# EAGLE design SmartCup1 (EAGLE 6.5.0)
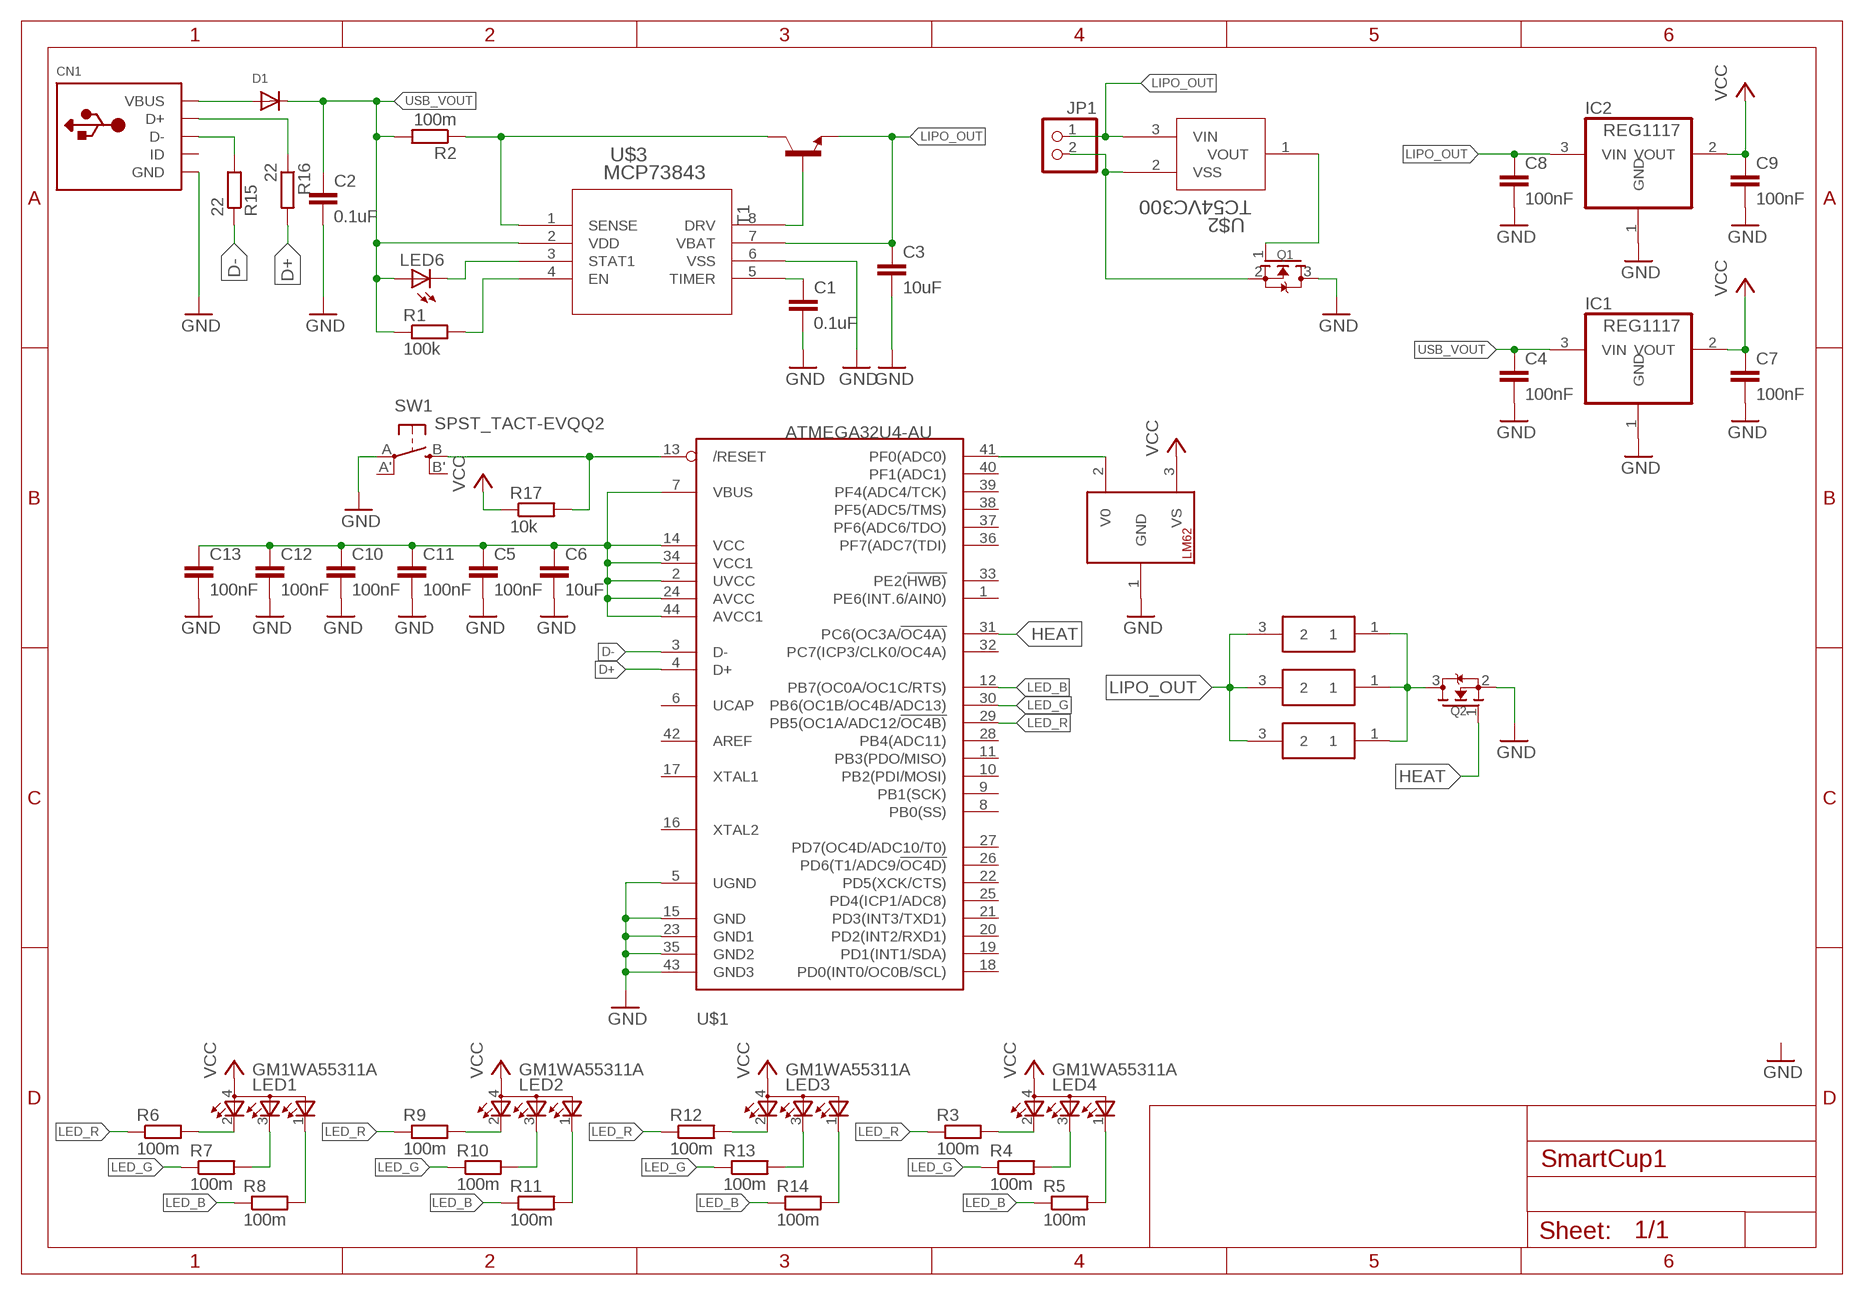
[diagram p0: schematic, sheet 1]

## Parts
C1  0.1uF  C-EUC0603  [C0603]
C2  0.1uF  C-EUC0603  [C0603]
C3  10uF  C-EUC0603  [C0603]
C4  100nF  C-EUC0603  [C0603]
C5  100nF  C-EUC0603  [C0603]
C6  10uF  C-EUC0805  [C0805]
C7  100nF  C-EUC0603  [C0603]
C8  100nF  C-EUC0603  [C0603]
C9  100nF  C-EUC0603  [C0603]
C10  100nF  C-EUC0603  [C0603]
C11  100nF  C-EUC0603  [C0603]
C12  100nF  C-EUC0603  [C0603]
C13  100nF  C-EUC0603  [C0603]
CN1  USBMINIB  [USB-MINIB]
D1  DIODE_SOD-123FL  [SOD-123FL]
IC1  REG1117  [SOT223]
IC2  REG1117  [SOT223]
JP1  PINHD-1X2  [1X02]
LED1  GM1WA55311A  [GM1WA55311A]
LED2  GM1WA55311A  [GM1WA55311A]
LED3  GM1WA55311A  [GM1WA55311A]
LED4  GM1WA55311A  [GM1WA55311A]
LED6  LEDCHIP-LED0603  [CHIP-LED0603]
Q1  MOSFET-NREFLOW  [SOT23]
Q2  MOSFET-NREFLOW  [SOT23]
R1  100k  R-EU_R0603  [R0603]
R2  100m  R-EU_R0603  [R0603]
R3  100m  R-EU_R0603  [R0603]
R4  100m  R-EU_R0603  [R0603]
R5  100m  R-EU_R0603  [R0603]
R6  100m  R-EU_R0603  [R0603]
R7  100m  R-EU_R0603  [R0603]
R8  100m  R-EU_R0603  [R0603]
R9  100m  R-EU_R0603  [R0603]
R10  100m  R-EU_R0603  [R0603]
R11  100m  R-EU_R0603  [R0603]
R12  100m  R-EU_R0603  [R0603]
R13  100m  R-EU_R0603  [R0603]
R14  100m  R-EU_R0603  [R0603]
R15  22  R-EU_R0603  [R0603]
R16  22  R-EU_R0603  [R0603]
R17  10k  R-EU_R0603  [R0603]
SW1  SPST_TACT-EVQQ2  [EVQ-Q2]
T1  -NPN-SOT23-EBC  [SOT23-EBC]
U$1  ATMEGA32U4-AU  [TQFP44]
U$2  TC54VC300  [SOT23]
U$3  MCP73843  [MSOP8_MC]
U$4  LM62TO-92  [TO92-]
U$6  BOURNS_PWR  [DPAK]
U$7  BOURNS_PWR  [DPAK]
U$8  BOURNS_PWR  [DPAK]

## Nets
D+: R16.2 U$1.4(D+)
D-: R15.1 U$1.3(D-)
GND: C1.2 C2.2 C3.2 C4.2 C5.2 C6.2 C7.2 C8.2 C9.2 C10.2 C11.2 C12.2 C13.2 CN1.GND IC1.1(GND) IC2.1(GND) Q1.3(D) Q2.2(S) SW1.A(P) U$1.5(UGND) U$1.15(GND) U$1.23(GND1) U$1.35(GND2) U$1.43(GND3) U$3.6(VSS) U$4.1(GND)
HEAT: Q2.1(G) U$1.31(PC6(OC3A/!OC4A))
LED_B: R5.1 R8.1 R11.1 R14.1 U$1.12(PB7(OC0A/OC1C/RTS))
LED_G: R4.1 R7.1 R10.1 R13.1 U$1.30(PB6(OC1B/OC4B/ADC13))
LED_R: R3.1 R6.1 R9.1 R12.1 U$1.29(PB5(OC1A/ADC12/!OC4B))
LIPO_OUT: C3.1 C8.1 IC2.3(VIN) JP1.1 T1.E U$2.3(VIN) U$3.7(VBAT) U$6.3 U$7.3 U$8.3
N$1: Q1.1(G) U$2.1(VOUT)
N$2: LED6.C U$3.3(STAT1)
N$3: CN1.VBUS D1.A
N$4: R1.2 U$3.4(EN)
N$5: T1.B U$3.8(DRV)
N$6: C1.1 U$3.5(TIMER)
N$7: LED4.2(CRED) R3.2
N$8: JP1.2 Q1.2(S) U$2.2(VSS)
N$9: LED3.2(CRED) R12.2
N$10: LED4.3(CBLUE) R4.2
N$11: R2.1 T1.C U$3.1(SENSE)
N$12: LED4.1(CGREEN) R5.2
N$13: LED1.2(CRED) R6.2
N$14: LED1.3(CBLUE) R7.2
N$15: LED1.1(CGREEN) R8.2
N$16: LED2.2(CRED) R9.2
N$17: LED2.3(CBLUE) R10.2
N$18: LED2.1(CGREEN) R11.2
N$19: LED3.3(CBLUE) R13.2
N$20: C5.1 C6.1 C10.1 C11.1 C12.1 C13.1 U$1.2(UVCC) U$1.7(VBUS) U$1.14(VCC) U$1.24(AVCC) U$1.34(VCC1) U$1.44(AVCC1)
N$21: LED3.1(CGREEN) R14.2
N$22: U$1.41(PF0(ADC0)) U$4.2(V0)
N$23: CN1.D- R15.2
N$24: CN1.D+ R16.1
N$25: R17.2 SW1.B(S) U$1.13(/RESET)
N$26: Q2.3(D) U$6.1 U$7.1 U$8.1
USB_VOUT: C2.1 C4.1 D1.C IC1.3(VIN) LED6.A R1.1 R2.2 U$3.2(VDD)
VCC: C7.1 C9.1 IC1.2(VOUT) IC2.2(VOUT) LED1.4(A) LED2.4(A) LED3.4(A) LED4.4(A) R17.1 U$4.3(VS)
Unconnected: CN1.ID SW1.A'(P1) SW1.B'(S1) U$1.1(PE6(INT.6/AIN0)) U$1.6(UCAP) U$1.8(PB0(SS)) U$1.9(PB1(SCK)) U$1.10(PB2(PDI/MOSI)) U$1.11(PB3(PDO/MISO)) U$1.16(XTAL2) U$1.17(XTAL1) U$1.18(PD0(INT0/OC0B/SCL)) U$1.19(PD1(INT1/SDA)) U$1.20(PD2(INT2/RXD1)) U$1.21(PD3(INT3/TXD1)) U$1.22(PD5(XCK/CTS)) U$1.25(PD4(ICP1/ADC8)) U$1.26(PD6(T1/ADC9/!OC4D)) U$1.27(PD7(OC4D/ADC10/T0)) U$1.28(PB4(ADC11)) U$1.32(PC7(ICP3/CLK0/OC4A)) U$1.33(PE2(!HWB)) U$1.36(PF7(ADC7(TDI)) U$1.37(PF6(ADC6/TDO)) U$1.38(PF5(ADC5/TMS)) U$1.39(PF4(ADC4/TCK)) U$1.40(PF1(ADC1)) U$1.42(AREF)

## Library data of the parts
C1-C13 = resistor:C-EU: CAPACITOR, European symbol
CN1 = adafruit:USB: USB Connectors USBMINIB - Surface Mount Female Mini-B USB Connector 4UConnector: 06564 By microbuilder.eu Thru-hole RA Female Mini-B USB Connector 4UConnector: 18732 By ladyada.net
D1 = adafruit:DIODE: Diode SMADIODE - SMA Surface Mount Package 20V 1A Schottky Diode Digikey: 641-1014-6-ND DO-1N4148 - Through Hole Small Current Diode SOD-123 20V 1 A (.5mV Vf) Schottky Diode - Digikey: MBRX120TPMSCT-ND SOD-323 10V 570mA (.38mV Vf, 3ns) Schottky Diode - Digikey: ZLLS410CT-ND SOD-523 30V 30mA Schottky Diode (RB751S-40TE61) - Digikey: RB751S-40TE61CT-ND SOT23-R/W - SOT23 Package (R = Solder Paste/Reflow Ovens, W = Hand-Soldering) BAT54Film 40V 300mA - Digikey: 497-7162-1-ND
IC1 IC2 = burr-brown:REG1117: 800mA and 1A Low Dropout (LDO) Positive Regulator 1.8V, 2.5V, 2.85V, 3.3V, 5V, and Adj; MPN: REG1117; OC_FARNELL: 1097566; OC_NEWARK: 14P6981
JP1 = pinhead:PINHD-1X2: PIN HEADER
LED1-LED4 = led:GM1WA55311A: Chip LED RGB Source: http://document.sharpsma.com/files/GM1WA55311A_SS.pdf
LED6 = adafruit:LED: LED OSRAM: - CHIPLED LG R971, LG N971, LY N971, LG Q971, LY Q971, LO R971, LY R971 LH N974, LH R974 LS Q976, LO Q976, LY Q976 LO Q996 - Hyper CHIPLED LW Q18S LB Q993, LB Q99A, LB R99A - SideLED LS A670, LO A670, LY A670, LG A670, LP A670 LB A673, LV A673, LT A673, LW A673 LH A674 LY A675 LS A676, LA A676, LO A676, LY A676, LW A676 LS A679, LY A679, LG A679 - Hyper Micro SIDELED® LS Y876, LA Y876, LO Y876, LY Y876 LT Y87S - SmartLED LW L88C, LW L88S LB L89C, LB L89S, LG L890 LS L89K, LO L89K, LY L89K LS L896, LA L896, LO L896, LY L896 - TOPLED LS T670, LO T670, LY T670, LG T670, LP T670 LSG T670, LSP T670, LSY T670, LOP T670, LYG T670 LG T671, LOG T671, LSG T671 LB T673, LV T673, LT T673, LW T673 LH T674 LS T676, LA T676, LO T676, LY T676, LB T676, LH T676, LSB T676, LW T676 LB T67C, LV T67C, LT T67C, LS T67K, LO T67K, LY T67K, LW E67C LS E67B, LA E67B, LO E67B, LY E67B, LB E67C, LV E67C, LT E67C LW T67C LS T679, LY T679, LG T679 LS T770, LO T770, LY T770, LG T770, LP T770 LB T773, LV T773, LT T773, LW T773 LH T774 LS E675, LA E675, LY E675, LS T675 LS T776, LA T776, LO T776, LY T776, LB T776 LHGB T686 LT T68C, LB T68C - Hyper Mini TOPLED® LB M676 - Mini TOPLED Santana® LG M470 LS M47K, LO M47K, LY M47K Source: http://www.osram.convergy.de/
Q1 Q2 = adafruit:MOSFET-N: N-Channel Mosfet 2N7002E - 60V 260mA SOT23 [Digikey: 2N7002ET1GOSTR-ND] - REEL BSH103 - 30V 850mA SOT23 [Digikey: 568-5013-1-ND]
R1-R17 = resistor:R-EU_: RESISTOR, European symbol
SW1 = adafruit:SPST_TACT: SMT 6mm switch, EVQQ2 series http://www.ladyada.net/library/eagle
T1 = transistor:*-NPN-: NPN Transistror BF959 corrected 2008.03.06
U$1 = adafruit:ATMEGA32U4: http://www.ladyada.net/library/eagle
U$2 = TC54VC27:TC54VC300
U$3 = MCP73843:MCP73843
U$4 = LM62:LM62
U$6-U$8 = BOURNS:BOURNS_PWR

## Board
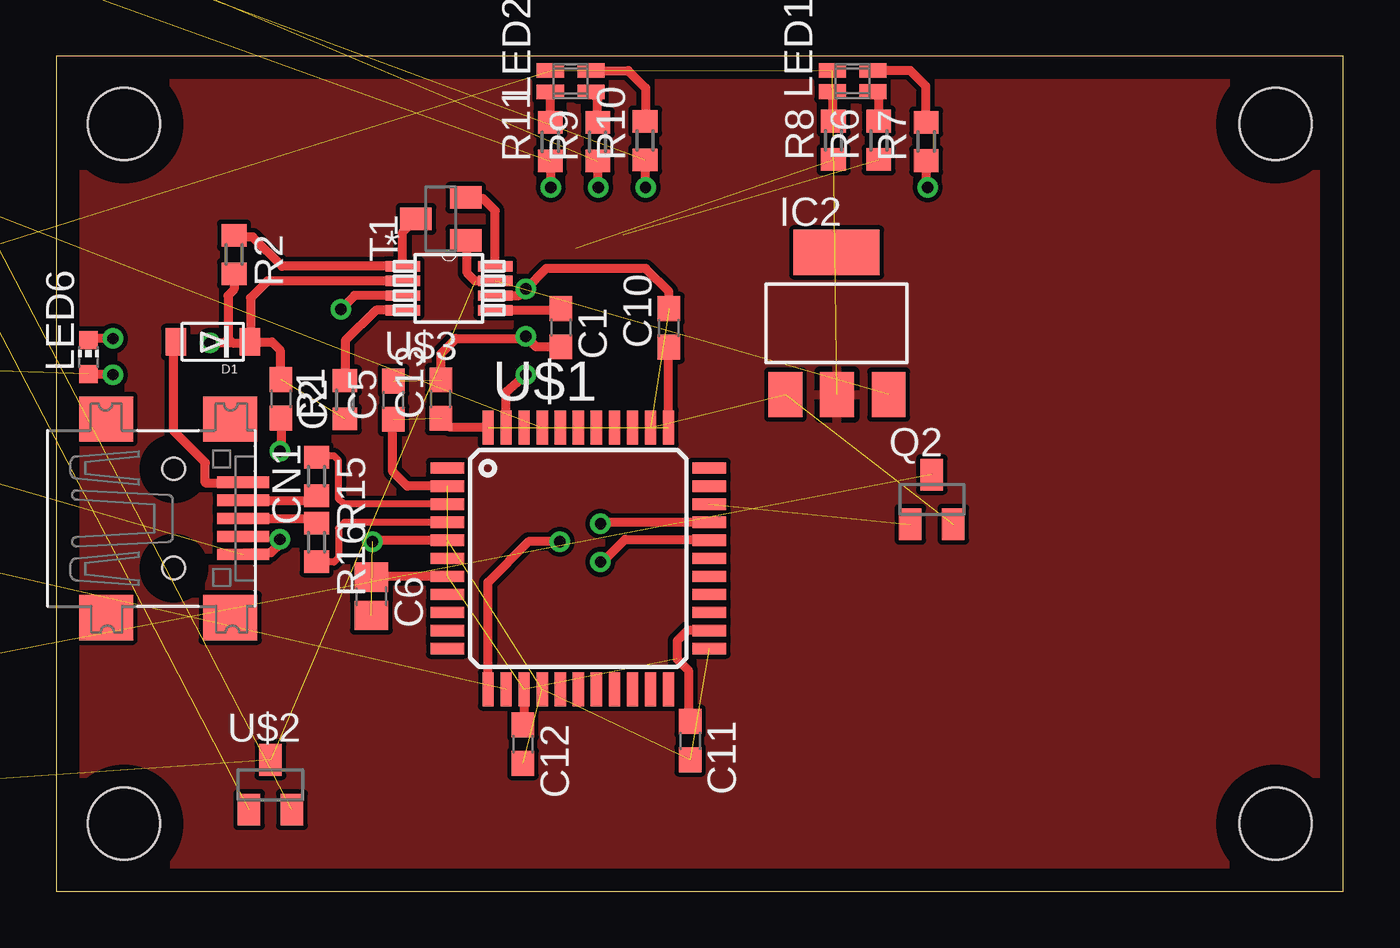
[diagram p1: board, top side]
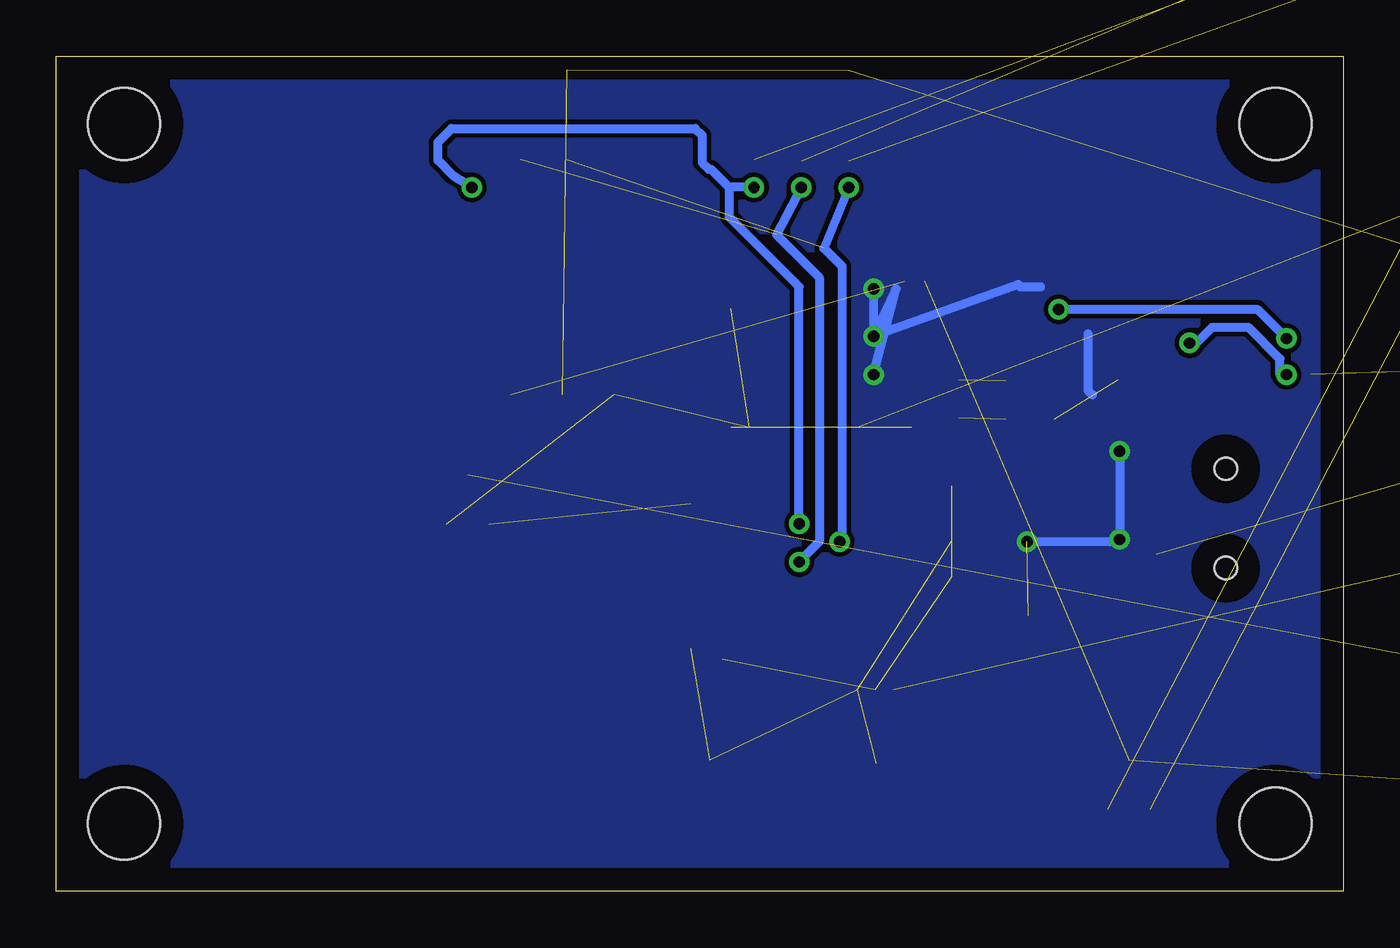
[diagram p2: board, bottom side, seen from below]

Size 57 x 37 mm. Coordinates in mm from the lower left corner, seen from the top.
Outline: 0,0 57,0 57,37 0,37 0,0
Copper layers (1*16): Top 0.035mm / dielectric 1.5mm / Bottom 0.035mm
Design rules "default": minimum track width 10mil, minimum drill 24mil, track to track 8mil, track to pad 8mil, pad to pad 8mil, via to via 8mil, smd to smd 8mil, copper to edge 40mil, drill to drill 8mil, minimum pad ring 10mil, minimum via ring 8mil, stop-mask expansion 4mil, vias tented up to drill 0mil, thermal gap 10mil
Holes 3.2 mm at 3,3 54,3 54,34 3,34

### Footprints (pad centres in the part's own frame; a part is rotated, then mirrored left to right if it is on the bottom)
C0603 = smd 1.1 x 1: 1 -0.85,0; 2 0.85,0
C0805 = smd 1.3 x 1.5: 1 -0.85,0; 2 0.85,0
USB-MINIB = smd 0.5 x 2.308: D+ 0,4.064; D- -0.8,4.064; GND 1.6,4.064; ID 0.8,4.064; VBUS -1.6,4.064 | smd 2 x 2.4: GND1 -4.4,-2; GND2 -4.4,3.5; GND3 4.4,3.5; GND4 4.4,-2 | hole 1: -2.2,1; 2.2,1
SOD-123FL = smd 0.91 x 1.22: A 1.637,0; C -1.637,0
SOT223 = smd 1.499 x 2.007: 1 -2.261,-3.15; 2 0.025,-3.15; 3 2.311,-3.15 | smd 3.81 x 2.007: 4 0,3.15
1X02 = drill 1.016 long: 1 -1.27,0; 2 1.27,0
GM1WA55311A = smd 0.65 x 1.2: 1 -0.475,0.9; 2 -0.475,-0.9; 3 0.475,-0.9; 4 0.475,0.9
CHIP-LED0603 = smd 0.8 x 0.8: A 0,-0.75; C 0,0.75
SOT23 = smd 1 x 1.4: 1 -0.95,-1.1; 2 0.95,-1.1; 3 0,1.1
R0603 = smd 1 x 1.1: 1 -0.85,0; 2 0.85,0
EVQ-Q2 = smd 3.2 x 1.2: A -3.4,-2; A' 3.4,-2; B -3.4,2; B' 3.4,2
SOT23-EBC = smd 1 x 1.4: B 0.95,-1.1; C 0,1.1; E -0.95,-1.1
TQFP44 = smd 1.5 x 0.5: 1 -5.8,4; 2 -5.8,3.2; 3 -5.8,2.4; 4 -5.8,1.6; 5 -5.8,0.8; 6 -5.8,0; 7 -5.8,-0.8; 8 -5.8,-1.6; 9 -5.8,-2.4; 10 -5.8,-3.2; 11 -5.8,-4; 23 5.8,-4; 24 5.8,-3.2; 25 5.8,-2.4; 26 5.8,-1.6; 27 5.8,-0.8; 28 5.8,0; 29 5.8,0.8; 30 5.8,1.6; 31 5.8,2.4; 32 5.8,3.2; 33 5.8,4 | smd 0.5 x 1.5: 12 -4,-5.8; 13 -3.2,-5.8; 14 -2.4,-5.8; 15 -1.6,-5.8; 16 -0.8,-5.8; 17 0,-5.8; 18 0.8,-5.8; 19 1.6,-5.8; 20 2.4,-5.8; 21 3.2,-5.8; 22 4,-5.8; 34 4,5.8; 35 3.2,5.8; 36 2.4,5.8; 37 1.6,5.8; 38 0.8,5.8; 39 0,5.8; 40 -0.8,5.8; 41 -1.6,5.8; 42 -2.4,5.8; 43 -3.2,5.8; 44 -4,5.8
MSOP8_MC = smd 1.524 x 0.457: 1 -2.045,0.975; 2 -2.045,0.325; 3 -2.045,-0.325; 4 -2.045,-0.975; 5 2.045,-0.975; 6 2.045,-0.325; 7 2.045,0.325; 8 2.045,0.975
TO92- = drill 0.813 long: 1 2.54,-1.27; 2 0,-1.27; 3 -2.54,-1.27
DPAK = smd 1.6 x 3: 1 -2.28,-4.04; 3 2.28,-4.04 | smd 4.826 x 4.191: 4 0,2.096

### Placement (x,y rotation side)
C1  22.35,24.98 270 top
C2  9.95,21.83 270 top
C3  -30.48,69.85 0 top  (outside the outline)
C4  -17.78,64.77 0 top  (outside the outline)
C5  14.93,21.77 90 top
C6  13.95,13.08 270 top
C7  -30.48,64.77 0 top  (outside the outline)
C8  -36.83,64.77 0 top  (outside the outline)
C9  -43.18,64.77 0 top  (outside the outline)
C10  27.13,24.97 90 top
C11  28.07,6.68 270 top
C12  20.67,6.53 270 top
C13  17.03,21.82 90 top
CN1  4.2,16.53 270 top
D1  6.93,24.35 180 top
IC1  -19.05,26.67 0 top  (outside the outline)
IC2  34.56,25.17 0 top
JP1  -60.96,44.45 0 top  (outside the outline)
LED1  35.27,35.91 90 top
LED2  22.78,35.9 90 top
LED3  -39.37,45.72 0 top  (outside the outline)
LED4  -53.34,45.72 0 top  (outside the outline)
LED6  1.42,23.68 0 top
Q1  -15.24,52.07 0 top  (outside the outline)
Q2  38.78,17.37 0 top
R1  12.78,21.79 90 top
R2  7.87,28.22 270 top
R3  -39.37,52.07 0 top  (outside the outline)
R4  -45.72,52.07 0 top  (outside the outline)
R5  -52.07,52.07 0 top  (outside the outline)
R6  36.43,33.28 90 top
R7  38.53,33.23 90 top
R8  34.43,33.28 90 top
R9  23.98,33.22 90 top
R10  26.08,33.27 90 top
R11  21.88,33.22 90 top
R12  -36.83,58.42 0 top  (outside the outline)
R13  -43.18,58.42 0 top  (outside the outline)
R14  -49.53,58.42 0 top  (outside the outline)
R15  11.52,18.39 270 top
R16  11.52,15.47 270 top
R17  -69.85,58.42 0 top  (outside the outline)
SW1  -57.15,25.4 0 top  (outside the outline)
T1  17.03,29.8 90 top
U$1  23.12,14.76 0 top
U$2  9.48,4.73 0 top
U$3  17.39,26.73 0 top
U$4  -20.32,38.1 0 top  (outside the outline)
U$6  -43.18,6.35 0 top  (outside the outline)
U$7  -54.61,6.35 0 top  (outside the outline)
U$8  -66.04,6.35 0 top  (outside the outline)

### Tracks (layer width: path | path; a pad name or v marks a point on that pad's centre or on a via)
D+
  Top 0.305: U$1.4 12.76,16.36 12.5,16.1 12.5,14.8 12.3,14.6 11.54,14.6 R16.2
D-
  Top 0.305: U$1.3 12.74,17.16 12.5,17.4 12.5,19.1 12.3,19.3 11.58,19.3 R15.1
GND  (via drill 0.5)  (18 unrouted)
  Top 0.406: C1.2 21.27,24.13 v20.8,24.6 20.7,24.5 17.7,24.5 17.03,23.83 C13.2 | U$3.6 20.5,26.41 v20.8,26.7 21.7,27.6 26.1,27.6 27.13,26.57 C10.2 | U$1.43 19.92,22.12 v20.8,22.9 | C2.2 9.95,19.55 v9.9,19.5 | v9.9,15.6 9.9,15.4 9.5,15 8.33,15 CN1.GND | U$1.5 14.06,15.56 v14,15.5
  Bottom 0.406: v20.8,24.6 14.4,26.9 14.3,26.8 13.4,26.8 | 11.3,24.7 11.3,22.2 11.1,22 | v20.8,26.7 v20.8,24.6 | v20.8,22.9 19.8,26.7 v20.8,24.6 | v9.9,19.5 v9.9,15.6 10,15.5 v14,15.5
  pour Bottom: 0,0 57,0 57,37 0,37
HEAT  (1 unrouted)
LED_B  (via drill 0.5)  (3 unrouted)
  Top 0.406: U$1.12 19.12,13.7 20.92,15.5 v22.3,15.5 | 21.9,32.35 R11.1 21.88,31.22 v21.9,31.2
  Bottom 0.406: v21.9,31.2 23,28.5 22.2,27.7 22.2,15.6 v22.3,15.5
LED_G  (via drill 0.5)  (2 unrouted)
  Top 0.406: U$1.30 24.16,16.36 v24.1,16.3 | R10.1 26.08,31.22 v26.1,31.2 | R7.1 38.53,31.27 v38.6,31.2
  Bottom 0.406: v24.1,16.3 24.1,26.8 27.2,29.9 27.2,31.2 | v26.1,31.2 27.2,31.2 | v38.6,31.2 39.4,31.7 40.1,32.4 40.1,33.2 39.5,33.8 28.7,33.8 28.4,33.5 28.4,32.3 28.1,32 28,32 27.2,31.2
LED_R  (via drill 0.5)  (3 unrouted)
  Top 0.406: R9.1 23.98,31.22 v24,31.2 | v24.1,14.6 24.2,14.6 25.2,15.6 28.88,15.6 U$1.29
  Bottom 0.406: v24,31.2 25.1,29.1 23.2,27.2 23.2,15.5 v24.1,14.6
LIPO_OUT  (8 unrouted)
  Top 0.406: U$3.7 18.55,27.05 18.2,27.4 18.2,28.78 T1.E
N$1  (1 unrouted)
N$2  (via drill 0.5)
  Top 0.406: U$3.3 13.21,26.41 v12.6,25.8 | v2.5,24.5 1.49,24.5 LED6.C
  Bottom 0.406: v12.6,25.8 3.8,25.8 v2.5,24.5
N$3
  Top 0.406: CN1.VBUS 8.23,18.1 6.6,18.1 6.6,19 5.2,20.4 5.2,24.26 D1.A
N$4
  Top 0.406: U$3.4 14.15,25.75 12.8,24.4 12.8,22.66 R1.2
N$5
  Top 0.406: U$3.8 19.43,30.16 18.9,30.7 18.18,30.7 T1.B
N$6
  Top 0.406: U$3.5 22.27,25.75 C1.1
N$7  (1 unrouted)
N$8  (2 unrouted)
N$9  (1 unrouted)
N$10  (1 unrouted)
N$11
  Top 0.406: R2.1 7.94,29 8.7,29 9.99,27.7 U$3.1 15.35,29.21 T1.C
N$12  (1 unrouted)
N$13
  Top 0.406: R6.2 36.43,35.17 LED1.2
N$14
  Top 0.406: LED1.3 37.81,36.38 38.5,35.7 38.5,34.11 R7.2
N$15
  Top 0.406: LED1.1 34.37,34.19 R8.2
N$16
  Top 0.406: R9.2 23.98,35.12 LED2.2
N$17
  Top 0.406: LED2.3 25.32,36.38 26.1,35.6 26.1,34.14 R10.2
N$18
  Top 0.406: R11.2 LED2.1
N$19  (1 unrouted)
N$20  (5 unrouted)
  Top 0.406: U$1.7 13.98,13.96 C6.1 | U$1.2 15.54,17.96 14.9,18.6 14.9,20.89 C5.1 | U$1.44 17.44,20.56 C13.1 | U$1.14 20.72,7.43 C12.1 | U$1.34 C10.1 | U$1.24 27.96,11.56 27.5,11.1 27.5,10.3 28,9.8 28,7.6 C11.1
N$21  (1 unrouted)
N$22  (1 unrouted)
N$23
  Top 0.406: CN1.D- 11.31,17.33 R15.2
N$24
  Top 0.406: CN1.D+ 11.31,16.53 R16.1
N$25  (2 unrouted)
N$26  (3 unrouted)
USB_VOUT  (via drill 0.5)  (3 unrouted)
  Top 0.406: U$3.2 9.36,27.05 8.6,26.3 8.6,24.38 D1.C | 1.45,22.9 LED6.A 2.47,22.93 v2.5,22.9 | D1.C 9.55,24.35 9.9,24 9.9,22.73 C2.1 | R2.2 7.87,26.67 7.6,26.4 7.6,24.5 7.8,24.3 | 7.8,24.3 8.52,24.3 D1.C | 7.8,24.3 v6.8,24.3
  Bottom 0.406: v2.5,22.9 2.8,22.9 2.8,23.6 4.2,25 5.8,25 6.5,24.3 v6.8,24.3
VCC  (9 unrouted)
  pour Top: 0,0 57,0 57,37 0,37